# EAGLE design Floor (EAGLE 9.2.0)
COMPANY: ADAFRUIT INDUSTRIES; DRAWN: KTOWN; REV: B
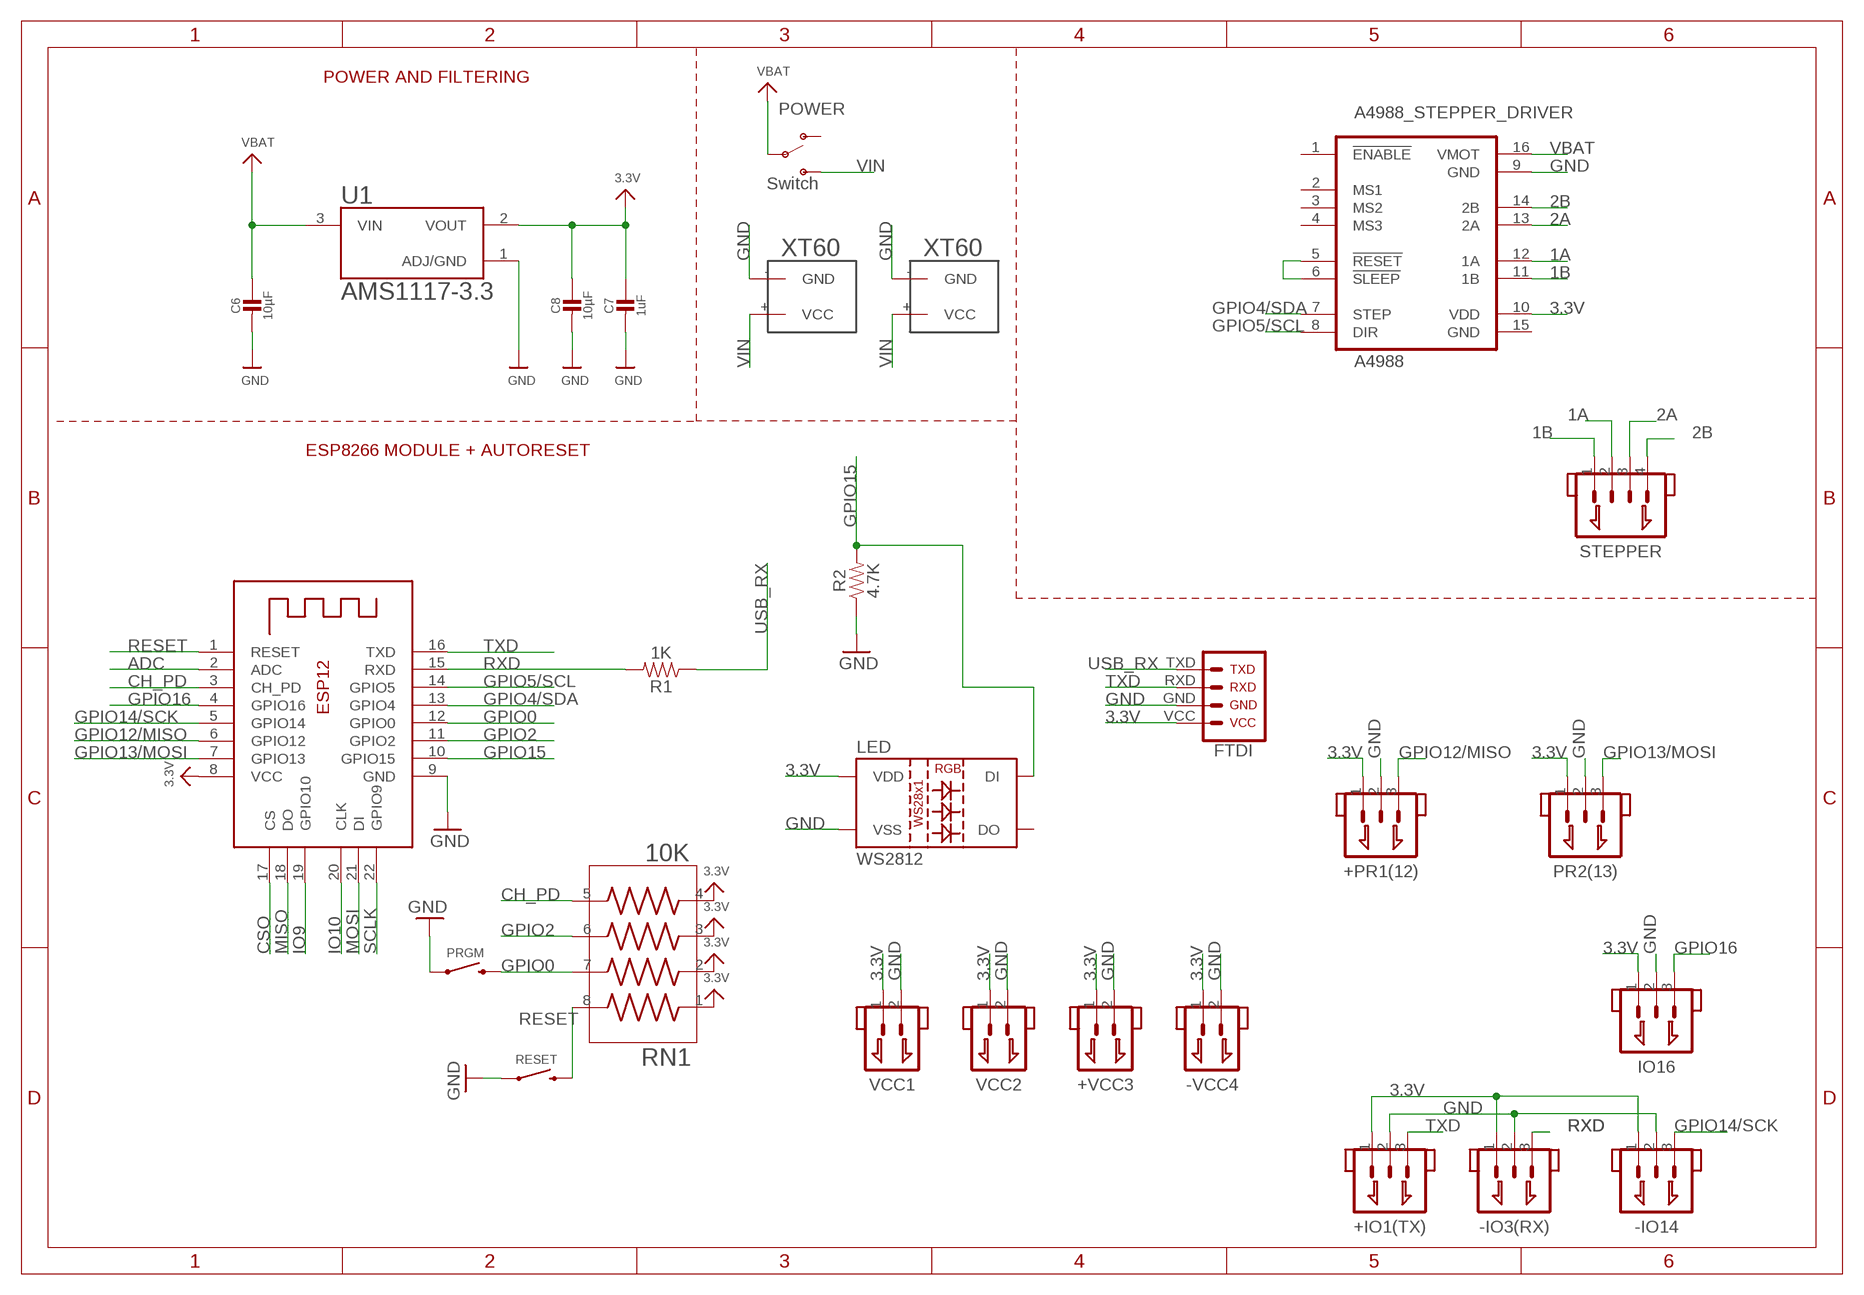
[diagram p0: schematic, sheet 1]

## Parts
+IO1(TX)  XH_2.54_3P  [XH2.54_3P]
+PR1(12)  XH_2.54_3P  [XH2.54_3P]
+VCC3  XH_2.54_2P  [XH2.54_2P]
-IO3(RX)  XH_2.54_3P  [XH2.54_3P]
-IO14  XH_2.54_3P  [XH2.54_3P]
-VCC4  XH_2.54_2P  [XH2.54_2P]
A4988  A4988_STEPPER_DRIVER  [A4988]
C6  10µF  MICROBUILDER_CAP_CERAMIC_0805  [MICROBUILDER__0805]
C7  1uF  MICROBUILDER_CAP_CERAMIC_0603  [MICROBUILDER__0603]
C8  10µF  MICROBUILDER_CAP_CERAMIC_0805  [MICROBUILDER__0805]
IO16  XH_2.54_3P  [XH2.54_3P]
LED  WS2812  [LED-TRICOLOR-5050-IC]
POWER  Switch  SWITCH_SPDT_SLIDE  [SWITCH_SPDT_PTH_11.6X4.0MM]
PR2(13)  XH_2.54_3P  [XH2.54_3P]
PRGM  PUSHBUTTON  [TACTILE_SWITCH_SMD_6.0X3.5MM]
R1  1K  RESISTOR1206  [1206]
R2  4.7K  RESISTOR1206  [1206]
RESET  PUSHBUTTON  [TACTILE_SWITCH_SMD_6.0X3.5MM]
RN1  10K  RESISTOR_ARRAY_1206  [RESCAF80P320X160X60-8N]
STEPPER  XH_2.54_4P  [XH2.54_4P]
U1  AMS1117-3.3  [SOT229P700X180-4N]
U$7  XT60  [XT60]
U$9  XT60  [XT60]
U$11  FTDI  [1X06]
VCC1  XH_2.54_2P  [XH2.54_2P]
VCC2  XH_2.54_2P  [XH2.54_2P]
X2  ESP-12  MICROBUILDER_ESP-12E  [MICROBUILDER_ESP-12E]

## Nets
1A: A4988.12(1A) STEPPER.2
1B: A4988.11(1B) STEPPER.1
2A: A4988.13(2A) STEPPER.3
2B: A4988.14(2B) STEPPER.4
3.3V: +IO1(TX).1 +PR1(12).1 +VCC3.1 -IO3(RX).1 -IO14.1 -VCC4.1 A4988.10(VDD) C7.1 C8.1 IO16.1 LED.VDD PR2(13).1 RN1.1 RN1.2 RN1.3 RN1.4 U1.2(VOUT) U$11.VCC VCC1.1 VCC2.1 X2.8(VCC)
ADC: X2.2(ADC)
CH_PD: RN1.5 X2.3(CH_PD)
CSO: X2.17(CS)
GND: +IO1(TX).2 +PR1(12).2 +VCC3.2 -IO3(RX).2 -IO14.2 -VCC4.2 A4988.9(GND) C6.2 C7.2 C8.2 IO16.2 LED.VSS PR2(13).2 PRGM.1 R2.1 RESET.1 U1.1(ADJ/GND) U$7.-(GND) U$9.-(GND) U$11.GND VCC1.2 VCC2.2 X2.9(GND)
GPIO0: PRGM.2 RN1.7 X2.12(GPIO0)
GPIO2: RN1.6 X2.11(GPIO2)
GPIO4/SDA: A4988.7(STEP) X2.13(GPIO4)
GPIO5/SCL: A4988.8(DIR) X2.14(GPIO5)
GPIO12/MISO: +PR1(12).3 X2.6(GPIO12)
GPIO13/MOSI: PR2(13).3 X2.7(GPIO13)
GPIO14/SCK: -IO14.3 X2.5(GPIO14)
GPIO15: LED.DIN(DI) R2.2 X2.10(GPIO15)
GPIO16: IO16.3 X2.4(GPIO16)
IO9: X2.19(GPIO10)
IO10: X2.20(CLK)
MISO: X2.18(DO)
MOSI: X2.21(DI)
N$1: A4988.5(!RESET) A4988.6(!SLEEP)
RESET: RESET.2 RN1.8 X2.1(RESET)
RXD: -IO3(RX).3 R1.2 X2.15(RXD)
SCLK: X2.22(GPIO9)
TXD: +IO1(TX).3 U$11.RXD X2.16(TXD)
USB_RX: R1.1 U$11.TXD
VBAT: A4988.16(VMOT) C6.1 POWER.2(P) U1.3(VIN)
VIN: POWER.3(S) U$7.+(VCC) U$9.+(VCC)
Unconnected: A4988.1(!ENABLE) A4988.2(MS1) A4988.3(MS2) A4988.4(MS3) LED.DOUT(DO) POWER.1(O)

## Notes on the sheet
- POWER AND FILTERING
- ESP8266 MODULE + AUTORESET

## Power pins joined to a net without a drawn wire
GND: A4988.15(GND)

## Library data of the parts
+IO1(TX) +PR1(12) -IO3(RX) -IO14 IO16 PR2(13) = AutoPark:XH_2.54_3P
+VCC3 -VCC4 VCC1 VCC2 = AutoPark:XH_2.54_2P
A4988 = AutoPark:A4988_STEPPER_DRIVER
C6-C8 = AutoPark:MICROBUILDER_CAP_CERAMIC: Ceramic Capacitors For new designs, use the packages preceded by an '_' character since they are more reliable: The following footprints should be used on most boards: _0402 - Standard footprint for regular board layouts _0603 - Standard footprint for regular board layouts _0805 - Standard footprint for regular board layouts _1206 - Standard footprint for regular board layouts For extremely tight-pitch boards where space is at a premium, the following 'micro-pitch' footprints can be used (smaller pads, no silkscreen outline, etc.): _0402MP - Micro-pitch footprint for very dense/compact boards _0603MP - Micro-pitch footprint for very dense/compact boards _0805MP - Micro-pitch footprint for very dense/compact boards _1206MP - Micro-pitch footprint for very dense/compact boards
LED = AutoPark:WS2812
POWER = AutoPark:SWITCH_SPDT_SLIDE: 拨动开关SK12D07VG2/3/4/5/6 侧面5脚拨动带支架 3脚2档柄高6MM Taobao <https://item.taobao.com/item.htm?spm=a1z09.2.0.0.53a62e8d0RVocC&id=563254128682&_u=s1po4ce26496> Dimensional Drawing <https://img.alicdn.com/imgextra/i1/2744920356/TB2568GkMDD8KJjy0FdXXcjvXXa_!!2744920356.jpg>
PRGM RESET = AutoPark:PUSHBUTTON
R1 R2 = SparkFun-Resistors:RESISTOR: Generic Resistor Package
RN1 = AutoPark:RESISTOR_ARRAY_1206: Res Thick Film Array 75 Ohm 5% 0.25W(1/4W) ?200ppm/C ISOL Molded 8-Pin 1206(4 X 0603) Convex SMD T/R; AVAILABILITY: Unavailable; DESCRIPTION: Res Thick Film Array 75 Ohm 5% 0.25W_1/4W_ ?200ppm/C ISOL Molded 8-Pin 1206_4 X 0603_ Convex SMD T/R; MF: Bourns; MP: CAY16-750J4LF; PACKAGE: 1206 Bourns; PRICE: None
STEPPER = AutoPark:XH_2.54_4P
U1 = AutoPark:AMS1117-3.3: Sot223/Pkg 1-Amp 3.3-Volt Low Drop Out Voltage Regulatator; AVAILABILITY: Unavailable; DESCRIPTION: Sot223/Pkg 1-Amp 3.3-Volt Low Drop Out Voltage Regulatator; MF: Advanced Monolithic Systems; MP: AMS1117-3.3; PACKAGE: None; PRICE: None
U$7 U$9 = AutoPark:XT60: XT60
U$11 = AutoPark:FTDI
X2 = AutoPark:MICROBUILDER_ESP-12E

## Board
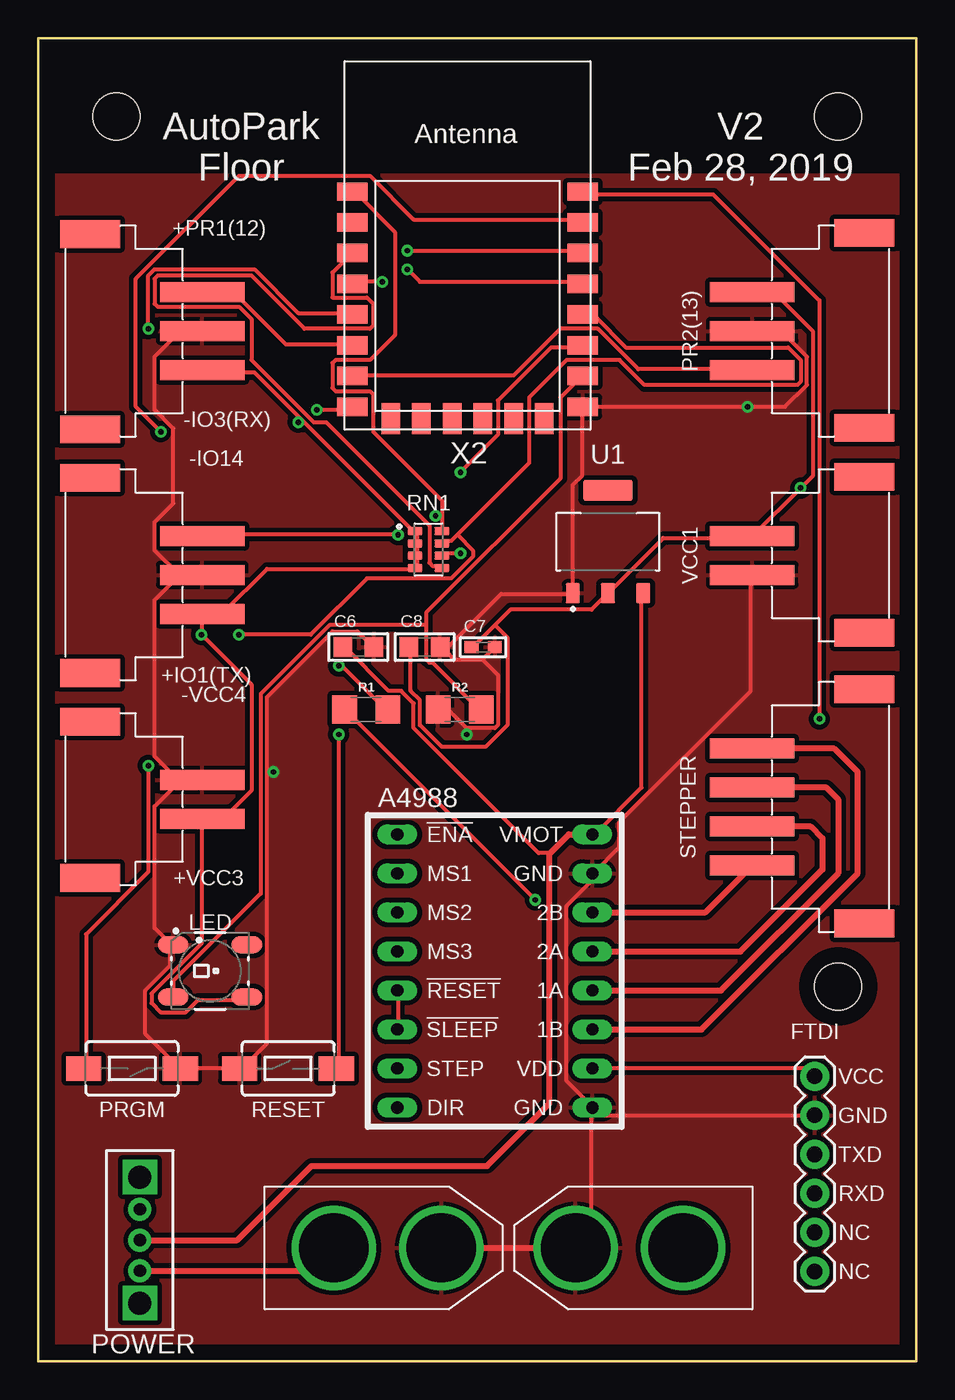
[diagram p1: board, top side]
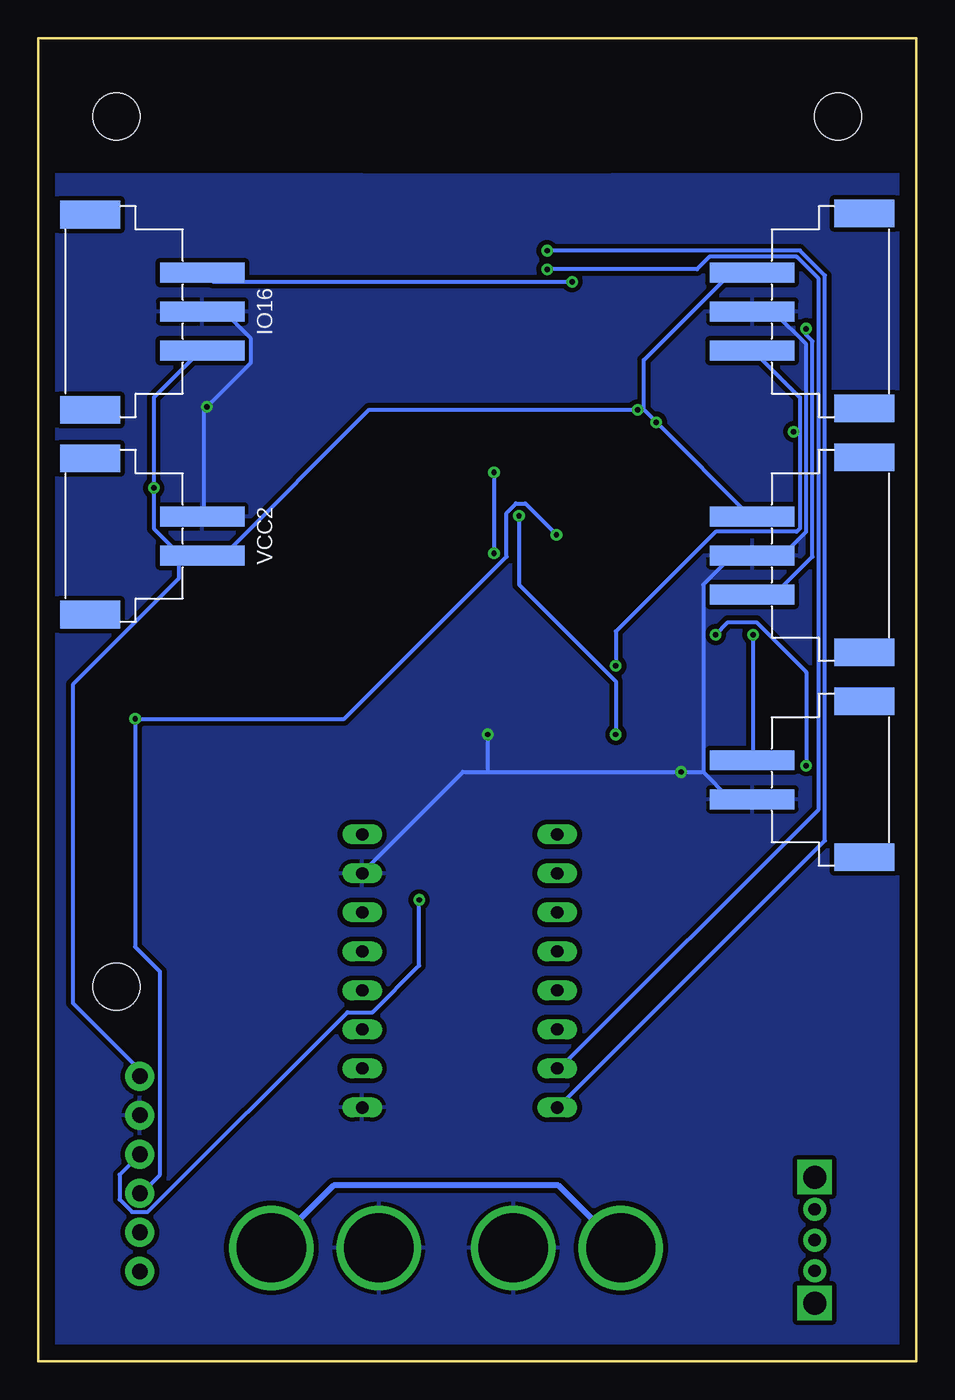
[diagram p2: board, bottom side, seen from below]

Size 57.15 x 86.11 mm. Coordinates in mm from the lower left corner, seen from the top.
Outline: 0,0 57.15,0 57.15,86.11 0,86.11 0,0
Copper layers (1*16): Top 0.035mm / dielectric 1.5mm / Bottom 0.035mm
Design rules "default *": minimum track width 10mil, minimum drill 0.35mm, track to track 6mil, track to pad 6mil, pad to pad 6mil, via to via 6mil, smd to smd 6mil, copper to edge 40mil, drill to drill 6mil, minimum pad ring 10mil, minimum via ring 8mil, stop-mask expansion 4mil, vias tented up to drill 15mil, thermal gap 10mil
Holes 3.05 mm at 5.08,81.03 52.07,81.03 52.07,24.38

### Footprints (pad centres in the part's own frame; a part is rotated, then mirrored left to right if it is on the bottom)
XH2.54_3P = smd 1.3 x 5.5: 1 -2.54,-5.334; 2 0,-5.334; 3 2.54,-5.334 | smd 1.8 x 3.9: NC@1 -6.39,1.966; NC@2 6.31,1.966
XH2.54_2P = smd 1.3 x 5.5: 1 -1.27,-5.334; 2 1.27,-5.334 | smd 1.8 x 3.9: NC@1 -5.12,1.966; NC@2 5.04,1.966
A4988 = drill 0.8 long: 1 -7.62,7.62; 2 -7.62,5.08; 3 -7.62,2.54; 4 -7.62,0; 5 -7.62,-2.54; 6 -7.62,-5.08; 7 -7.62,-7.62; 8 -7.62,-10.16; 9 5.08,-10.16; 10 5.08,-7.62; 11 5.08,-5.08; 12 5.08,-2.54; 13 5.08,0; 14 5.08,2.54; 15 5.08,5.08; 16 5.08,7.62
MICROBUILDER__0805 = smd 1.2 x 1.3: 1 -1.016,0; 2 1.016,0
MICROBUILDER__0603 = smd 0.9 x 0.8: 1 -0.762,0; 2 0.762,0
LED-TRICOLOR-5050-IC = smd 2 x 1.1: DIN -2.4,-1.7; DOUT 2.4,1.7; VDD 2.4,-1.7; VSS -2.4,1.7
SWITCH_SPDT_PTH_11.6X4.0MM = drill 0.8 pad 1.5: 1 0,2; 2 0,0; 3 0,-2 | drill 1.5 pad 1.8 square: P$1 0,-4.1; P$2 0,4.1
TACTILE_SWITCH_SMD_6.0X3.5MM = smd 2.3 x 1.6: 1 -3.15,0; 2 3.15,0
1206 = smd 1.6 x 1.8: 1 -1.4,0; 2 1.4,0
RESCAF80P320X160X60-8N = smd 0.97 x 0.53: 1 -0.875,1.2; 2 -0.875,0.4; 3 -0.875,-0.4; 4 -0.875,-1.2; 5 0.875,-1.2; 6 0.875,-0.4; 7 0.875,0.4; 8 0.875,1.2
XH2.54_4P = smd 1.3 x 5.5: 1 -3.81,-5.334; 2 -1.27,-5.334; 3 1.27,-5.334; 4 3.81,-5.334 | smd 1.8 x 3.9: NC@1 -7.66,1.966; NC@2 7.58,1.966
SOT229P700X180-4N = smd 0.93 x 1.31: 1 -2.29,-3.345; 2 0,-3.345; 3 2.29,-3.345 | smd 3.24 x 1.31: 4 0,3.345
XT60 = drill 4.5: + 4.5,0; - 11.5,0
1X06 = drill 1.016 pad 1.88: GND 0,1.27; NC@1 0,-6.35; NC@2 0,-8.89; RXD 0,-3.81; TXD 0,-1.27; VCC 0,3.81
MICROBUILDER_ESP-12E = smd 2 x 1.2: 1 -7.5,5.77; 2 -7.5,3.77; 3 -7.5,1.77; 4 -7.5,-0.23; 5 -7.5,-2.23; 6 -7.5,-4.23; 7 -7.5,-6.23; 8 -7.5,-8.23; 9 7.5,-8.23; 10 7.5,-6.23; 11 7.5,-4.23; 12 7.5,-2.23; 13 7.5,-0.23; 14 7.5,1.77; 15 7.5,3.77; 16 7.5,5.77 | smd 1.2 x 2: 17 -5,-9; 18 -3,-9; 19 -1,-9; 20 1,-9; 21 3,-9; 22 5,-9

### Placement (x,y rotation side)
+IO1(TX)  5.33,51.18 90 top
+PR1(12)  5.33,67.06 90 top
+VCC3  5.33,36.58 90 top
-IO3(RX)  5.33,68.33 270 bottom
-IO14  5.33,52.45 270 bottom
-VCC4  5.33,37.85 270 bottom
A4988  30.99,26.67 0 top
C6  20.83,46.48 0 top
C7  28.96,46.48 0 top
C8  25.15,46.48 0 top
IO16  51.82,68.33 90 bottom
LED  11.18,25.4 0 top
POWER  6.6,7.87 0 top
PR2(13)  51.82,67.06 270 top
PRGM  6.1,19.05 180 top
R1  21.34,42.42 0 top
R2  27.43,42.42 0 top
RESET  16.26,19.05 0 top
RN1  25.4,52.83 0 top
STEPPER  51.82,36.07 270 top
U1  37.08,53.34 0 top
U$7  14.73,7.37 0 top
U$9  46.48,7.37 180 top
U$11  50.55,14.73 0 top
VCC1  51.82,52.45 270 top
VCC2  51.82,53.72 90 bottom
X2  27.94,70.36 0 top

### Tracks (layer width: path | path; a pad name or v marks a point on that pad's centre or on a via)
1A
  Top 0.406: A4988.12 44.45,24.13 52.07,31.75 52.07,36.58 51.31,37.34 STEPPER.2
1B
  Top 0.406: A4988.11 43.18,21.59 53.34,31.75 53.34,38.35 51.82,39.88 STEPPER.1
2A
  Top 0.406: A4988.13 45.72,26.67 51.05,32 51.05,34.04 50.29,34.8 STEPPER.3
2B
  Top 0.406: A4988.14 43.43,29.21 STEPPER.4
3.3V  (via drill 0.35)
  Top 0.254: v18.14,61.92 20.37,61.92 X2.8 | LED.VDD 13.46,23.52 10.41,23.52 9.6,22.71 7.98,22.71 7.37,23.32 7.37,23.93 10.62,27.18 10.62,35.31 +VCC3.1 12.04,35.31 13.87,37.13 13.87,44.04 v10.62,47.29 10.62,48.51 +IO1(TX).1 10.82,48.72 12.04,48.72 14.88,51.56 24.43,51.56 RN1.4 24.64,51.76 24.64,52.38 RN1.3 24.64,52.58 24.64,53.19 RN1.2 24.64,53.39 24.64,54 RN1.1 24.43,54 17.12,61.32 | 17.12,61.32 14.07,64.36 10.82,64.36 +PR1(12).1 | 17.12,61.32 v16.92,61.11 | 29.72,47.9 30.73,48.92 36.02,48.92 37.03,49.94 U1.2 37.24,50.14 40.69,53.59 46.38,53.59 VCC1.1 46.58,53.8 v49.63,56.84 50.44,57.66 50.44,67.01 48.01,69.44 46.58,69.44 PR2(13).1 | 29.72,47.9 28.3,46.48 C7.1 | 29.72,47.9 30.53,47.09 30.53,41.4 29.11,39.98 26.26,39.98 24.84,41.4 24.84,43.03 24.23,43.64 24.23,46.48 C8.1 | A4988.10 50.04,19.05 U$11.VCC
  Bottom 0.254: 17.73,61.92 v18.14,61.92 35.61,61.92 44.96,52.58 46.38,52.58 VCC2.1 | 17.73,61.92 v16.92,61.11 10.82,55.02 -IO14.1 | -IO3(RX).1 12.04,70.87 17.73,65.18 17.73,61.92 | v10.62,47.29 10.62,39.17 -VCC4.1 | 48.01,52.58 46.58,52.58 VCC2.1 | 48.01,52.58 49.63,54.2 v49.63,56.84 49.63,62.74 46.58,65.79 IO16.1 | 48.01,52.58 48.01,50.95 54.92,44.04 54.92,23.32 50.65,19.05 50.65,18.64 U$11.VCC | 48.01,52.58 VCC2.1
CH_PD
  Top 0.254: RN1.5 26.26,51.76 25.65,51.76 25.45,51.97 25.45,54.41 18.75,61.11 17.93,61.11 13.87,65.18 13.87,67.82 13.06,68.63 7.77,68.63 7.57,68.83 7.57,70.46 7.77,70.66 13.87,70.66 17.32,67.21 21.59,67.21 21.79,67.41 21.79,68.83 21.39,69.24 19.15,69.24 19.15,70.87 20.37,72.09 X2.3
GND  (via drill 0.35)
  Top 0.254: 14.88,38.35 14.88,20.68 13.26,19.05 RESET.1 PRGM.1 9.2,19.05 6.96,21.29 6.96,24.13 8.59,25.76 8.59,26.98 LED.VSS 8.59,27.18 7.57,28.19 7.57,36.12 9.2,37.74 | 14.88,38.35 14.88,43.23 19.15,47.5 20.78,47.5 21.79,46.48 C6.2 | 9.2,37.74 10.62,37.74 +VCC3.2 9.2,37.74 | 9.2,51.16 10.62,51.16 +IO1(TX).2 9.2,51.16 | 9.2,51.16 7.57,49.53 7.57,39.37 9.2,37.74 | 9.2,51.16 7.57,52.78 7.57,54.61 8.79,55.83 8.79,60.71 7.57,61.92 7.57,65.38 9.2,67.01 10.62,67.01 +PR1(12).2 | 28.91,45.67 C7.2 | 28.91,45.67 27.08,45.67 26.47,46.28 | 26.47,46.28 26.26,46.48 C8.2 26.47,46.28 | 26.47,46.28 30.12,49.94 34.6,49.94 U1.1 34.8,50.14 34.8,57.05 35.41,57.66 35.41,61.92 X2.9 35.61,62.13 v46.18,62.13 48.62,62.13 50.04,63.55 50.04,65.38 48.41,67.01 46.58,67.01 PR2(13).2 | R2.1 26.67,42.42 27.89,41.2 | 27.89,41.2 29.72,41.2 29.92,41.4 29.92,44.65 28.91,45.67 | 36.02,16 36.02,8.48 35,7.47 U$9.- | 36.02,16 36.02,16.41 A4988.9 | A4988.9 36.02,16.61 34.39,18.24 34.39,29.62 36.02,31.24 36.02,31.65 A4988.15 36.22,31.85 37.85,33.48 37.85,35.1 46.38,43.64 46.38,51.16 VCC1.2 | 36.02,16 U$11.GND | 36.02,16 A4988.9 | v27.89,40.79 27.89,41.2 | v15.29,38.35 14.88,38.35
  Top 0.406: U$7.- U$9.-
  Bottom 0.254: VCC2.2 46.38,55.02 46.38,61.92 v46.18,62.13 43.33,64.97 43.33,66.6 44.96,68.22 46.38,68.22 IO16.2 | 13.87,38.35 12.24,36.73 10.82,36.73 -VCC4.2 | 13.87,38.35 13.87,50.55 12.04,52.38 10.82,52.38 -IO14.2 10.62,52.58 8.59,52.58 7.16,54 7.16,66.19 9.2,68.22 10.62,68.22 -IO3(RX).2 | 27.89,38.35 29.52,38.35 36.02,31.85 A4988.15 | 27.89,38.35 v15.29,38.35 13.87,38.35 | 27.89,38.35 v27.89,40.79
  pour Bottom (isolate 0.305): 0,77.22 57.15,77.22 57.15,0 0,0
  pour Top (isolate 0.305): 0,77.22 57.15,77.22 57.15,0 0,0
GPIO0  (via drill 0.35)
  Top 0.254: 27.28,53.8 31.95,58.47 31.95,62.74 34.39,65.18 37.85,65.18 39.47,63.55 49.43,63.55 49.63,63.75 49.63,65.18 48.82,65.99 38.25,65.99 36.22,68.02 35.61,68.02 X2.12 | 27.28,53.8 26.87,53.39 26.47,53.39 RN1.7 | v7.16,38.76 7.16,31.85 3.1,27.79 3.1,19.05 PRGM.2 | v13.06,47.29 17.73,47.29 21.39,50.95 26.87,50.95 28.3,52.38 28.3,52.78 27.28,53.8
  Bottom 0.254: v7.16,38.76 7.16,44.86 10.41,48.11 12.24,48.11 v13.06,47.29
GPIO2  (via drill 0.35)
  Top 0.254: v27.48,52.58 26.47,52.58 RN1.6 | v27.48,57.86 29.92,60.3 29.92,62.53 33.38,65.99 35.41,65.99 X2.11
  Bottom 0.254: v27.48,57.86 v27.48,52.58
GPIO4/SDA  (via drill 0.35)
  Top 0.254: v24.03,71.07 24.84,70.26 35.41,70.26 X2.13
  Bottom 0.254: v24.03,71.07 14.28,71.07 13.46,71.88 7.77,71.88 6.35,70.46 6.35,35.92 23.22,19.05 A4988.7
GPIO5/SCL  (via drill 0.35)
  Top 0.254: v24.03,72.29 35.41,72.29 X2.14
  Bottom 0.254: v24.03,72.29 7.57,72.29 5.94,70.66 5.94,33.88 23.22,16.61 A4988.8
GPIO12/MISO
  Top 0.254: X2.6 20.37,66.19 16.1,66.19 12.85,69.44 10.82,69.44 +PR1(12).3
GPIO13/MOSI
  Top 0.254: X2.7 20.57,64.16 30.94,64.16 33.99,67.21 36.42,67.21 39.07,64.57 46.38,64.57 PR2(13).3
GPIO14/SCK  (via drill 0.35)
  Top 0.254: v7.16,67.21 7.16,70.66 7.57,71.07 14.07,71.07 16.92,68.22 20.37,68.22 X2.5
  Bottom 0.254: v7.16,67.21 7.16,66.8 6.76,66.4 6.76,52.38 9.2,49.94 10.62,49.94 -IO14.3
GPIO15
  Top 0.254: 25.25,47.9 25.25,48.72 33.99,57.45 33.99,62.74 35.41,64.16 X2.10 | 25.25,47.9 25.25,45.67 25.45,45.47 25.65,45.47 28.7,42.42 R2.2 | 25.25,47.9 18.95,47.9 14.48,43.43 14.48,30.43 8.79,24.74 8.79,23.72 LED.DIN
GPIO16  (via drill 0.35)
  Top 0.254: v22.4,70.26 20.57,70.26 X2.4
  Bottom 0.254: v22.4,70.26 45.77,70.26 46.38,70.87 IO16.3
N$1
  Top 0.254: A4988.6 23.42,21.69 23.42,24.13 A4988.5
RESET  (via drill 0.35)
  Top 0.254: 26.26,55.02 26.26,56.03 21.79,60.5 21.79,62.94 21.59,63.14 19.36,63.14 19.15,63.35 19.15,64.97 19.36,65.18 21.59,65.18 23.22,66.8 23.22,73.51 20.57,76.15 X2.1 | 26.26,55.02 26.26,54.2 RN1.8 | v19.56,40.79 19.56,19.05 RESET.2 | 26.26,55.02 v25.86,55.02
  Bottom 0.254: v19.56,40.79 19.56,44.25 25.86,50.55 v25.86,55.02
RXD  (via drill 0.35)
  Top 0.254: v19.56,45.26 19.76,45.26 22.61,42.42 R1.2 | v7.98,60.5 6.35,62.13 6.35,70.46 13.06,77.17 21.59,77.17 24.43,74.32 35.41,74.32 X2.15
  Bottom 0.254: v19.56,45.26 19.56,47.5 13.06,54 7.77,54 7.57,54.2 7.57,60.5 | 7.57,60.5 7.57,62.74 10.62,65.79 -IO3(RX).3 | 7.57,60.5 v7.98,60.5
TXD  (via drill 0.35)
  Top 0.254: v50.85,41.81 50.85,69.04 43.94,75.95 35.61,75.95 X2.16 | v23.42,53.8 10.82,53.8 +IO1(TX).3
  Bottom 0.254: U$11.RXD 50.44,10.92 49.23,12.14 49.23,25.35 50.85,26.98 v50.85,41.81 37.24,41.81 26.67,52.38 26.67,55.22 26.06,55.83 25.45,55.83 v23.42,53.8
USB_RX  (via drill 0.35)
  Top 0.254: v32.36,30.02 19.96,42.42 R1.1
  Bottom 0.254: v32.36,30.02 32.36,25.76 35.41,22.71 37.03,22.71 50.04,9.7 51.05,9.7 51.87,10.52 51.87,12.14 U$11.TXD
VBAT
  Top 0.254: C6.1 19.96,46.48 22.81,43.64 23.62,43.64 24.43,42.82 24.43,41.2 32.56,33.07 33.17,33.07 33.27,33.02 | U1.3 39.27,49.94 39.27,37.34 36.22,34.29 A4988.16
  Top 0.406: POWER.2 12.95,7.87 17.78,12.7 29.21,12.7 33.27,16.76 33.27,33.02 34.54,34.29 A4988.16
VIN
  Top 0.406: POWER.3 17.74,5.87 U$7.+
  Bottom 0.406: U$7.+ 23.3,11.43 37.92,11.43 U$9.+

### Text on the board
tPlace: AutoPark / Floor | V2 / Feb 28, 2019